# Altium project GMSK Prototyping Board.PrjPcb
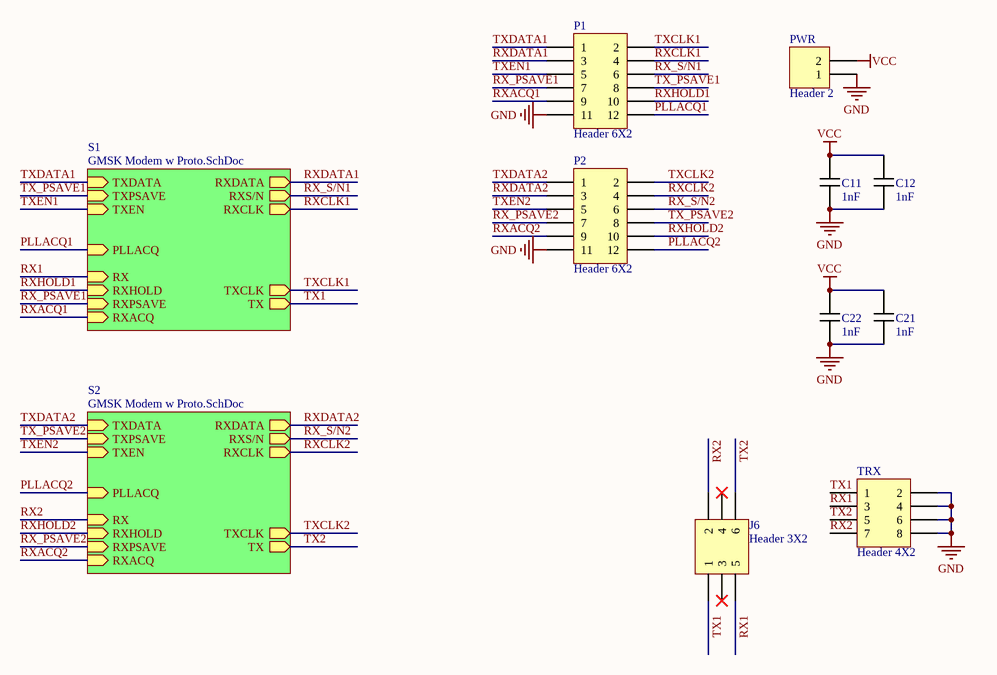
[diagram p0: PAYL0008 GMSK Prototyping Board.SchDoc]
1 sheet, 9 parts. Net scope: hierarchical (ports join the sheet entries above them; power ports are global).
Board file: PAYL0009 GMSK Prototyping Board.PcbDoc

## Sheet PAYL0008 GMSK Prototyping Board.SchDoc: GMSK Prototyping Board
size A3; Author: Daniel Jedrychowski; CompanyName: BLUESAT Satellite Project; Engineer: Daniel Jedrychowski; Organization: BLUESat Project; Address1: Room 419; Address2: School of EE&T; Address3: UNSW, NSW 2052; Address4: Australia; DocumentNumber: PAYL0008; SheetNumber: 1; SheetTotal: 2; Description: Board housing 2 GMSK Modems with loopback capability; Version: 1.0

### Parts
C11  value 1nF  [0805 Cap]  (hidden comment: 0805 Cap)
C12  value 1nF  [0805 Cap]  (hidden comment: 0805 Cap)
C21  value 1nF  [0805 Cap]  (hidden comment: 0805 Cap)
C22  value 1nF  [0805 Cap]  (hidden comment: 0805 Cap)
J6  Header 3X2  [HDR2X3]
P1  Header 6X2  [HDR2X6]
P2  Header 6X2  [HDR2X6]
PWR  Header 2  [HDR1X2]
TRX  Header 4X2  [HDR2X4]

### Sub-sheets
S1 = GMSK Modem w Proto.SchDoc (file not in this document): TX (out), RX (in), TXDATA (in), RXDATA (out), RXCLK (out), TXCLK (out), PLLACQ (in), RXACQ (in), TXEN (in), RXHOLD (in), TXPSAVE (in), RXPSAVE (in), RXS/N (out)
S2 = GMSK Modem w Proto.SchDoc (file not in this document): TX (out), RX (in), TXDATA (in), RXDATA (out), RXCLK (out), TXCLK (out), PLLACQ (in), RXACQ (in), TXEN (in), RXHOLD (in), TXPSAVE (in), RXPSAVE (in), RXS/N (out)

### Nets
GND: C11.2 C12.2 C21.1 C22.1 P1.11 P2.11 PWR.1 TRX.2 TRX.4 TRX.6 TRX.8
VCC: C11.1 C12.1 C21.2 C22.2 PWR.2
PLLACQ1: P1.12 ; sheet S1/PLLACQ
PLLACQ2: P2.12 ; sheet S2/PLLACQ
RX1: J6.5 TRX.3 ; sheet S1/RX
RX2: J6.2 TRX.7 ; sheet S2/RX
RX_PSAVE1: P1.7 ; sheet S1/RXPSAVE
RX_PSAVE2: P2.7 ; sheet S2/RXPSAVE
RX_S/N1: P1.6 ; sheet S1/RXS/N
RX_S/N2: P2.6 ; sheet S2/RXS/N
RXACQ1: P1.9 ; sheet S1/RXACQ
RXACQ2: P2.9 ; sheet S2/RXACQ
RXCLK1: P1.4 ; sheet S1/RXCLK
RXCLK2: P2.4 ; sheet S2/RXCLK
RXDATA1: P1.3 ; sheet S1/RXDATA
RXDATA2: P2.3 ; sheet S2/RXDATA
RXHOLD1: P1.10 ; sheet S1/RXHOLD
RXHOLD2: P2.10 ; sheet S2/RXHOLD
TX1: J6.1 TRX.1 ; sheet S1/TX
TX2: J6.6 TRX.5 ; sheet S2/TX
TX_PSAVE1: P1.8 ; sheet S1/TXPSAVE
TX_PSAVE2: P2.8 ; sheet S2/TXPSAVE
TXCLK1: P1.2 ; sheet S1/TXCLK
TXCLK2: P2.2 ; sheet S2/TXCLK
TXDATA1: P1.1 ; sheet S1/TXDATA
TXDATA2: P2.1 ; sheet S2/TXDATA
TXEN1: P1.5 ; sheet S1/TXEN
TXEN2: P2.5 ; sheet S2/TXEN

Not connected (* = marked no-connect by the designer): J6 3* 4*

### Notes on the sheet
- Title
- Description:
- Size:
- Author:
- Date:
- A3
- Time:
- Version
- Sheet:
- Drawing No.:
- of
- File:

### Library data of the parts
C11 C12 C21 C22 = 0805 MLCC - X7R, 10%
J6 = Header 3X2: Header, 3-Pin, Dual row; LatestRevisionDate: 17-Jul-2002; LatestRevisionNote: Re-released for DXP Platform.; Publisher: Altium Limited
P1 P2 = Header 6X2: Header, 6-Pin, Dual row; LatestRevisionDate: 17-Jul-2002; LatestRevisionNote: Re-released for DXP Platform.; Publisher: Altium Limited
PWR = Header 2: Header, 2-Pin; LatestRevisionDate: 17-Jul-2002; LatestRevisionNote: Re-released for DXP Platform.; Publisher: Altium Limited
TRX = Header 4X2: Header, 4-Pin, Dual row; LatestRevisionDate: 17-Jul-2002; LatestRevisionNote: Re-released for DXP Platform.; Publisher: Altium Limited